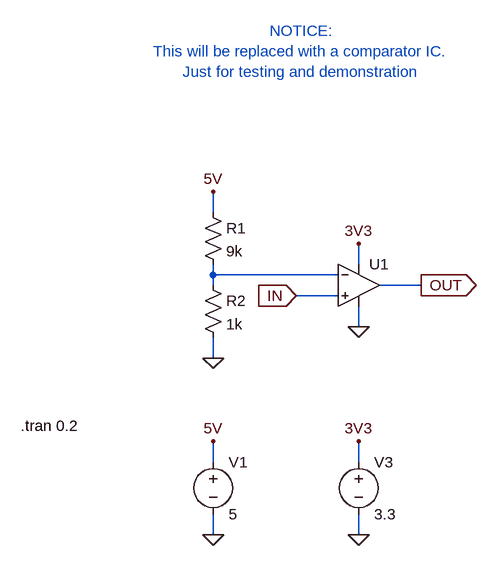
[diagram p0: schematic thresholdDetector.asc]
thresholdDetector.asc, the LTspice schematic file:
Version 4
SHEET 1 880 680
WIRE 16 16 16 -16
WIRE 240 96 240 64
WIRE 16 112 16 96
WIRE 208 112 16 112
WIRE 16 128 16 112
WIRE 336 128 272 128
WIRE 208 144 144 144
WIRE 240 192 240 160
WIRE 16 240 16 208
WIRE 16 400 16 368
WIRE 240 400 240 368
WIRE 16 512 16 480
WIRE 240 512 240 480
FLAG 16 512 0
FLAG 240 512 0
FLAG 16 368 5V
FLAG 16 -16 5V
FLAG 240 64 3V3
FLAG 240 368 3V3
FLAG 16 240 0
FLAG 144 144 IN
IOPIN 144 144 In
FLAG 336 128 OUT
IOPIN 336 128 Out
FLAG 240 192 0
SYMBOL res 0 0 R0
SYMATTR InstName R1
SYMATTR Value 9k
SYMBOL res 0 112 R0
SYMATTR InstName R2
SYMATTR Value 1k
SYMBOL voltage 16 384 R0
WINDOW 123 0 0 Left 0
WINDOW 39 0 0 Left 0
SYMATTR InstName V1
SYMATTR Value 5
SYMBOL voltage 240 384 R0
WINDOW 123 0 0 Left 0
WINDOW 39 0 0 Left 0
SYMATTR InstName V3
SYMATTR Value 3.3
SYMBOL OpAmps\\UniversalOpAmp2 240 128 R0
SYMATTR InstName U1
SYMATTR Value2 Avol=1Meg GBW=5Meg Slew=12Meg Vos=3m
TEXT -280 344 Left 2 !.tran 0.2
TEXT 152 -232 Center 2 ;NOTICE:\nThis will be replaced with a comparator IC.\nJust for testing and demonstration

The netlist it stands for:
* thresholdDetector.asc
R1 5V N001 9k
R2 N001 0 1k
V1 5V 0 5
V3 3V3 0 3.3
XU1 IN N001 3V3 0 OUT level2 Avol=1Meg GBW=5Meg Slew=12Meg Vos=3m Ilimit=25m Rail=0 Vos=0 En=0 Enk=0 In=0 Ink=0 Rin=500Meg  ; pins In+ In- V+ V- OUT
.tran 0.2
* NOTICE:
* This will be replaced with a comparator IC.
* Just for testing and demonstration
.lib UniversalOpAmp2.lib
.backanno
.end